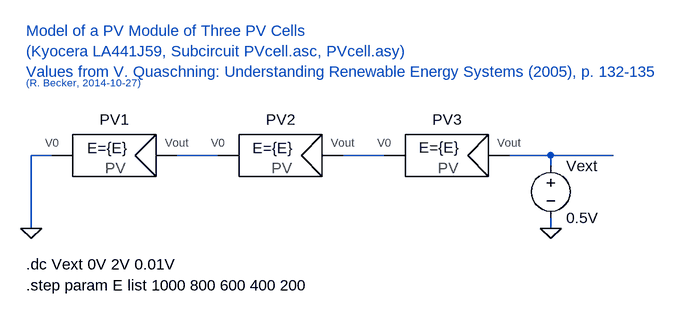
[diagram p0: schematic PVmodule_03Cells.asc]
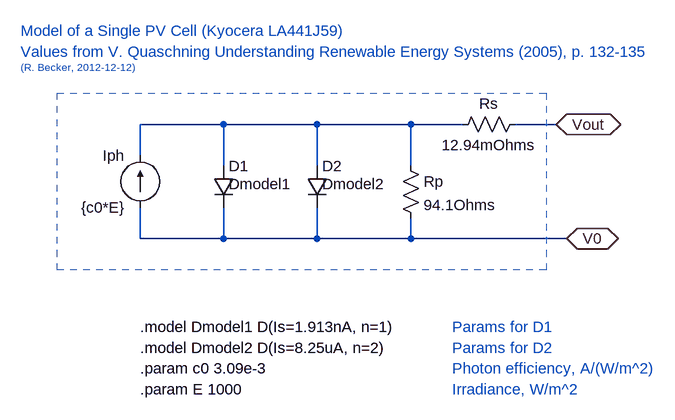
[diagram p1: sub-circuit pvcell.asc]
PVmodule_03Cells.asc, the LTspice schematic file:
Version 4
SHEET 1 1120 680
WIRE 0 160 -32 160
WIRE 256 160 192 160
WIRE 512 160 448 160
WIRE 768 160 704 160
WIRE 864 160 768 160
WIRE 768 176 768 160
WIRE -32 272 -32 160
WIRE 768 272 768 256
FLAG -32 272 0
FLAG 768 272 0
SYMBOL PVcell 96 160 R0
WINDOW 39 -11 4 Bottom 2
SYMATTR SpiceLine E={E}
SYMATTR InstName PV1
SYMATTR SpiceModel ""
SYMBOL PVcell 352 160 R0
WINDOW 39 -12 4 Bottom 2
SYMATTR SpiceLine E={E}
SYMATTR InstName PV2
SYMATTR SpiceModel ""
SYMBOL PVcell 608 160 R0
WINDOW 39 -12 3 Bottom 2
SYMATTR SpiceLine E={E}
SYMATTR InstName PV3
SYMATTR SpiceModel ""
SYMBOL voltage 768 160 R0
WINDOW 123 0 0 Left 2
WINDOW 39 0 0 Left 2
SYMATTR InstName Vext
SYMATTR Value 0.5V
TEXT -40 328 Left 2 !.dc Vext 0V 2V 0.01V
TEXT -40 360 Left 2 !.step param E list 1000 800 600 400 200
TEXT -40 -32 Left 2 ;Model of a PV Module of Three PV Cells \n(Kyocera LA441J59, Subcircuit PVcell.asc, PVcell.asy)\nValues from V. Quaschning: Understanding Renewable Energy Systems (2005), p. 132-135
TEXT -40 48 Left 1 ;(R. Becker, 2014-10-27)

pvcell.asc, the sub-circuit schematic file:
Version 4
SHEET 1 880 680
WIRE 0 32 -128 32
WIRE 144 32 0 32
WIRE 288 32 144 32
WIRE 368 32 288 32
WIRE 512 32 448 32
WIRE -128 80 -128 32
WIRE 0 96 0 32
WIRE 144 96 144 32
WIRE 288 96 288 32
WIRE -128 208 -128 160
WIRE 0 208 0 160
WIRE 0 208 -128 208
WIRE 144 208 144 160
WIRE 144 208 0 208
WIRE 288 208 288 176
WIRE 288 208 144 208
WIRE 528 208 288 208
FLAG 512 32 Vout
IOPIN 512 32 BiDir
FLAG 528 208 V0
IOPIN 528 208 BiDir
SYMBOL diode -16 96 R0
WINDOW 3 24 28 Left 2
SYMATTR Value Dmodel1
SYMATTR InstName D1
SYMBOL current -128 160 R180
WINDOW 0 24 80 Left 2
WINDOW 3 24 0 Left 2
SYMATTR InstName Iph
SYMATTR Value {c0*E}
SYMBOL diode 128 96 R0
WINDOW 3 24 28 Left 2
SYMATTR Value Dmodel2
SYMATTR InstName D2
SYMBOL res 272 80 R0
SYMATTR InstName Rp
SYMATTR Value 94.1Ohms
SYMBOL res 464 16 R90
WINDOW 0 0 56 VBottom 2
WINDOW 3 32 56 VTop 2
SYMATTR InstName Rs
SYMATTR Value 12.94mOhms
TEXT -128 344 Left 2 !.model Dmodel1 D(Is=1.913nA, n=1)
TEXT -128 376 Left 2 !.model Dmodel2 D(Is=8.25uA, n=2)
TEXT -128 408 Left 2 !.param c0 3.09e-3
TEXT -312 -80 Left 2 ;Values from V. Quaschning Understanding Renewable Energy Systems (2005), p. 132-135
TEXT -312 -112 Left 2 ;Model of a Single PV Cell (Kyocera LA441J59)
TEXT -312 -56 Left 1 ;(R. Becker, 2012-12-12)
TEXT -128 440 Left 2 !.param E 1000
TEXT 352 440 Left 2 ;Irradiance, W/m^2
TEXT 352 408 Left 2 ;Photon efficiency, A/(W/m^2)
TEXT 352 344 Left 2 ;Params for D1
TEXT 352 376 Left 2 ;Params for D2
RECTANGLE Normal 496 256 -256 -16 1

The netlist it stands for:
* PVmodule_03Cells.asc
XPV1 0 N001 pvcell params: E={E}
XPV2 N001 N002 pvcell params: E={E}
XPV3 N002 N003 pvcell params: E={E}
Vext N003 0 0.5V

* block symbol definitions
.subckt pvcell V0 Vout
D1 N001 V0 Dmodel1
Iph V0 N001 {c0*E}
D2 N001 V0 Dmodel2
Rp N001 V0 94.1Ohms
Rs Vout N001 12.94mOhms
.model Dmodel1 D(Is=1.913nA, n=1)
.model Dmodel2 D(Is=8.25uA, n=2)
.param c0 3.09e-3
* Values from V. Quaschning Understanding Renewable Energy Systems (2005), p. 132-135
* Model of a Single PV Cell (Kyocera LA441J59)
* (R. Becker, 2012-12-12)
.param E 1000
* Irradiance, W/m^2
* Photon efficiency, A/(W/m^2)
* Params for D1
* Params for D2
.ends pvcell

.model D D
.lib standard.dio
.dc Vext 0V 2V 0.01V
.step param E list 1000 800 600 400 200
* Model of a PV Module of Three PV Cells
* (Kyocera LA441J59, Subcircuit PVcell.asc, PVcell.asy)
* Values from V. Quaschning: Understanding Renewable Energy Systems (2005), p. 132-135
* (R. Becker, 2014-10-27)
.backanno
.end